# EAGLE design MegaAMP.Mk2 (EAGLE 6.5.0)
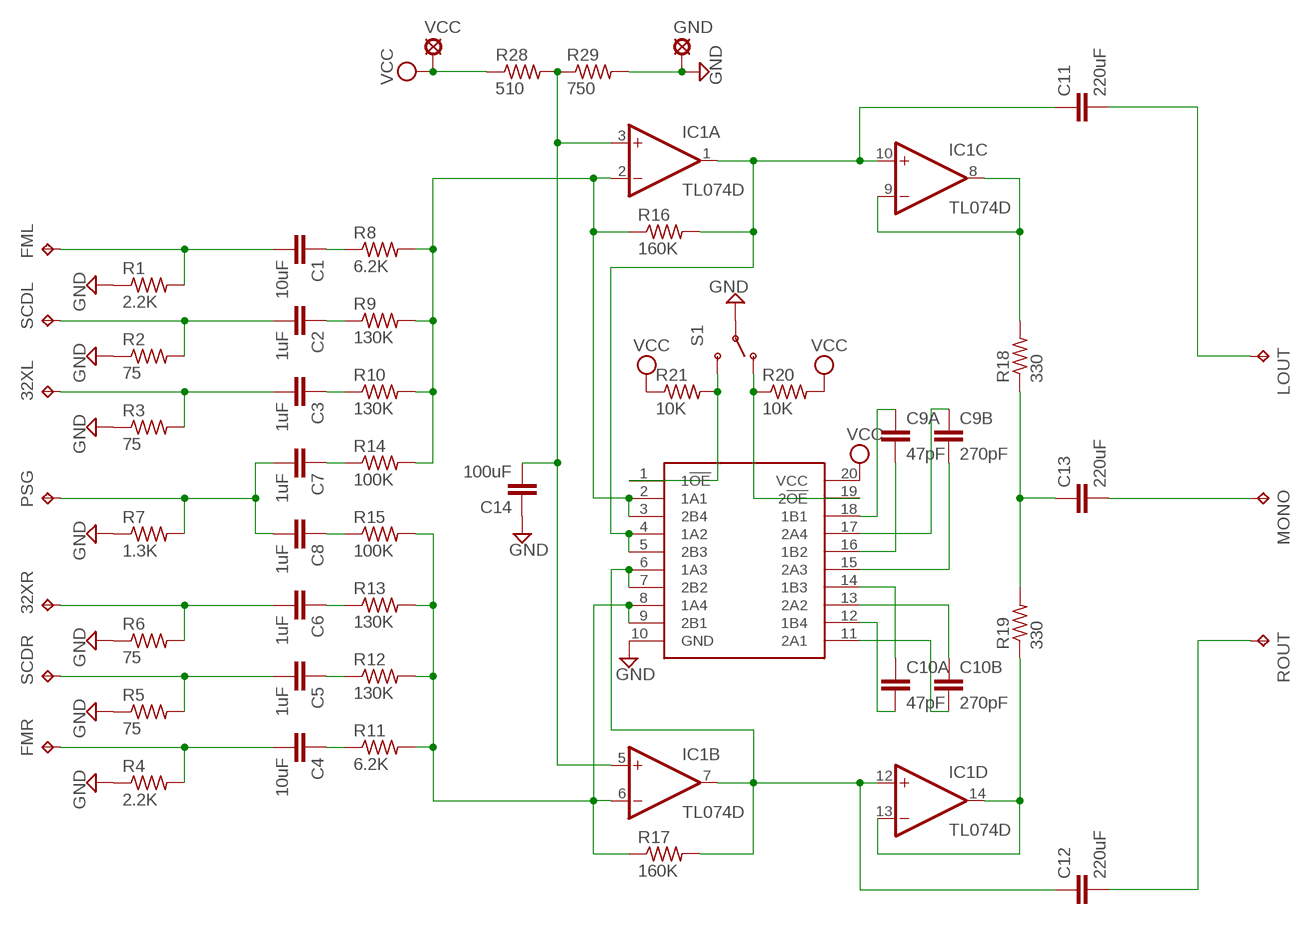
[diagram p0: schematic, sheet 1]

## Parts
32XL  TPTP20R  [TP20R]
32XR  TPTP20R  [TP20R]
C1  10uF  C-EUC0805  [C0805]
C2  1uF  C-EUC0805  [C0805]
C3  1uF  C-EUC0805  [C0805]
C4  10uF  C-EUC0805  [C0805]
C5  1uF  C-EUC0805  [C0805]
C6  1uF  C-EUC0805  [C0805]
C7  1uF  C-EUC0805  [C0805]
C8  1uF  C-EUC0805  [C0805]
C9A  47pF  C-EUC0805  [C0805]
C9B  270pF  C-EUC0805  [C0805]
C10A  47pF  C-EUC0805  [C0805]
C10B  270pF  C-EUC0805  [C0805]
C11  220uF  C-EUC1210  [C1210]
C12  220uF  C-EUC1210  [C1210]
C13  220uF  C-EUC1210  [C1210]
C14  100uF  C-EUC1206  [C1206]
FML  TPTP20R  [TP20R]
FMR  TPTP20R  [TP20R]
GND  LSP13  [LSP13]
IC1  TL074D  [SO14]
LOUT  TPTP20R  [TP20R]
MONO  TPTP20R  [TP20R]
PSG  TPTP20R  [TP20R]
R1  2.2K  R-US_R0805  [R0805]
R2  75  R-US_R0805  [R0805]
R3  75  R-US_R0805  [R0805]
R4  2.2K  R-US_R0805  [R0805]
R5  75  R-US_R0805  [R0805]
R6  75  R-US_R0805  [R0805]
R7  1.3K  R-US_R0805  [R0805]
R8  6.2K  R-US_R0805  [R0805]
R9  130K  R-US_R0805  [R0805]
R10  130K  R-US_R0805  [R0805]
R11  6.2K  R-US_R0805  [R0805]
R12  130K  R-US_R0805  [R0805]
R13  130K  R-US_R0805  [R0805]
R14  100K  R-US_R0805  [R0805]
R15  100K  R-US_R0805  [R0805]
R16  160K  R-US_R0805  [R0805]
R17  160K  R-US_R0805  [R0805]
R18  330  R-US_R0805  [R0805]
R19  330  R-US_R0805  [R0805]
R20  10K  R-US_R0805  [R0805]
R21  10K  R-US_R0805  [R0805]
R28  510  R-US_R0805  [R0805]
R29  750  R-US_R0805  [R0805]
ROUT  TPTP20R  [TP20R]
S1  SWITCH-SPDTPTH  [SWITCH-SPDT]
SCDL  TPTP20R  [TP20R]
SCDR  TPTP20R  [TP20R]
U$1  DBQ(R-PDS0-G20)  [DBQ(R-PDSO-G20)]
VCC  LSP13  [LSP13]

## Nets
GND: C14.1 GND.MP R1.1 R2.1 R3.1 R4.1 R5.1 R6.1 R7.1 R29.2 S1.2(P) U$1.10(GND)
N$1: IC1.2(A:-IN) R8.2 R9.2 R10.2 R14.2 R16.1 U$1.2(1A1) U$1.3(2B4)
N$2: C13.1 R18.1 R19.2
N$3: R21.2 S1.3(S) U$1.1(1!OE)
N$4: C12.2 ROUT.TP
N$5: C14.2 IC1.3(A:+IN) IC1.5(B:+IN) R28.2 R29.1
N$6: C9A.1 U$1.18(1B1)
N$7: IC1.8(C:OUT) IC1.9(C:-IN) R18.2
N$8: C9A.2 U$1.16(1B2)
N$9: IC1.13(D:-IN) IC1.14(D:OUT) R19.1
N$10: C10A.1 U$1.14(1B3)
N$11: C10A.2 U$1.12(1B4)
N$12: R20.1 S1.1(O) U$1.19(2!OE)
N$13: C12.1 IC1.7(B:OUT) IC1.12(D:+IN) R17.2 U$1.6(1A3) U$1.7(2B2)
N$15: C9B.1 U$1.17(2A4)
N$16: C9B.2 U$1.15(2A3)
N$17: C10B.1 U$1.13(2A2)
N$18: C10B.2 U$1.11(2A1)
N$19: IC1.6(B:-IN) R11.2 R12.2 R13.2 R15.2 R17.1 U$1.8(1A4) U$1.9(2B1)
N$20: C11.2 LOUT.TP
N$21: C13.2 MONO.TP
N$22: C1.2 FML.TP R1.2
N$23: C2.2 R2.2 SCDL.TP
N$24: 32XL.TP C3.2 R3.2
N$25: C7.2 C8.2 PSG.TP R7.2
N$26: 32XR.TP C6.2 R6.2
N$27: C5.2 R5.2 SCDR.TP
N$28: C4.2 FMR.TP R4.2
N$29: C1.1 R8.1
N$30: C2.1 R9.1
N$31: C3.1 R10.1
N$32: C7.1 R14.1
N$33: C8.1 R15.1
N$34: C6.1 R13.1
N$35: C5.1 R12.1
N$36: C4.1 R11.1
N$43: C11.1 IC1.1(A:OUT) IC1.10(C:+IN) R16.2 U$1.4(1A2) U$1.5(2B3)
VCC: R20.2 R21.1 R28.1 U$1.20(VCC) VCC.MP

## Power pins joined to a net without a drawn wire
V+: IC1.4(P:V+)
V-: IC1.11(P:V-)

## Library data of the parts
32XL 32XR FML FMR LOUT MONO PSG ROUT SCDL SCDR = testpad:TP: Test pad
C1-C8 C9A C9B C10A C10B = rcl:C-EU: CAPACITOR, European symbol
C11-C14 = resistor:C-EU: CAPACITOR, European symbol
GND VCC = solpad:LSP13: SOLDER PAD drill 1.3 mm, distributor Buerklin, 12H562
IC1 = linear:TL074: OP AMP
R1-R21 R28 R29 = resistor:R-US_: RESISTOR, American symbol
S1 = SparkFun-Electromechanical:SWITCH-SPDT: SPDT Switch Simple slide switch, Spark Fun Electronics SKU : COM-00102 DPDT SMT slide switch, AYZ0202, SWCH-08179
U$1 = TI SN74CBT3244:DBQ(R-PDS0-G20)

## Board
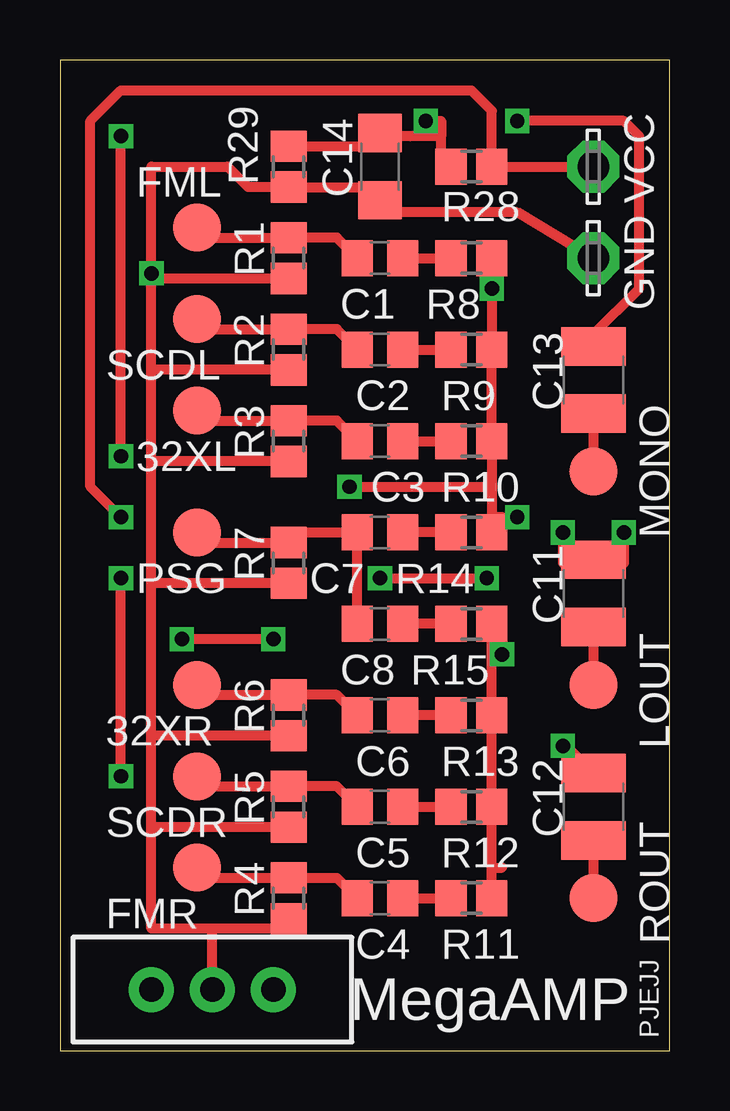
[diagram p1: board, top side]
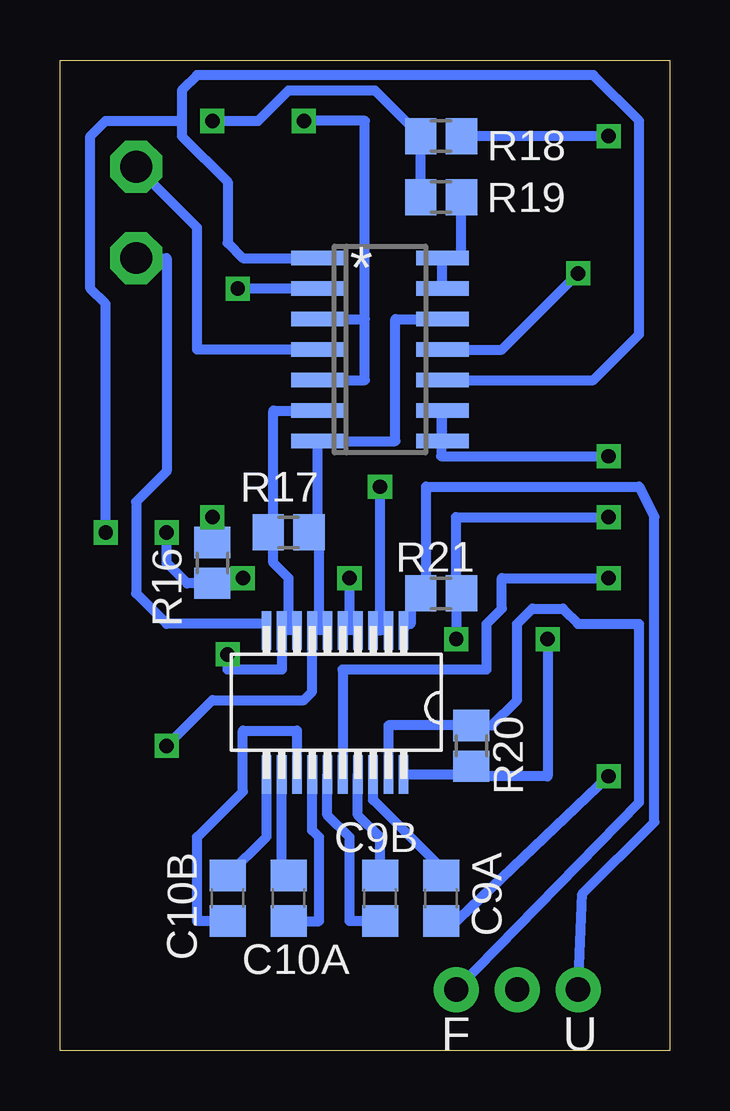
[diagram p2: board, bottom side, seen from below]

Size 25.4 x 41.27 mm. Coordinates in mm from the lower left corner, seen from the top.
Outline: 0,0 25.4,0 25.4,41.27 0,41.27 0,0
Copper layers (1*16): Top 0.035mm / dielectric 1.5mm / Bottom 0.035mm
Design rules "default": minimum track width 10mil, minimum drill 0.6mm, track to track 8mil, track to pad 8mil, pad to pad 8mil, via to via 8mil, smd to smd 8mil, copper to edge 40mil, drill to drill 8mil, minimum pad ring 10mil, minimum via ring 8mil, stop-mask expansion 4mil, vias tented up to drill 0mil, thermal gap 10mil

### Footprints (pad centres in the part's own frame; a part is rotated, then mirrored left to right if it is on the bottom)
TP20R = smd 2 x 2: TP 0,0
C0805 = smd 1.3 x 1.5: 1 -0.95,0; 2 0.95,0
C1210 = smd 1.6 x 2.7: 1 -1.4,0; 2 1.4,0
C1206 = smd 1.6 x 1.8: 1 -1.4,0; 2 1.4,0
LSP13 = drill 1.321 pad 2.159 octagon: MP 0,0
SO14 = smd 0.6 x 2.2: 1 -3.81,-2.6; 2 -2.54,-2.6; 3 -1.27,-2.6; 4 0,-2.6; 5 1.27,-2.6; 6 2.54,-2.6; 7 3.81,-2.6; 8 3.81,2.6; 9 2.54,2.6; 10 1.27,2.6; 11 0,2.6; 12 -1.27,2.6; 13 -2.54,2.6; 14 -3.81,2.6
R0805 = smd 1.3 x 1.5: 1 -0.85,0; 2 0.85,0
SWITCH-SPDT = drill 1.016 pad 1.88: 1 0,2.54; 2 0,0; 3 0,-2.54
DBQ(R-PDSO-G20) = smd 0.4 x 1.6: 1 1.555,-1; 2 2.19,-1; 3 2.825,-1; 4 3.46,-1; 5 4.095,-1; 6 4.73,-1; 7 5.365,-1; 8 6,-1; 9 6.635,-1; 10 7.27,-1; 11 7.27,4.999; 12 6.635,4.999; 13 6,4.999; 14 5.365,4.999; 15 4.73,4.999; 16 4.095,4.999; 17 3.46,4.999; 18 2.825,4.999; 19 2.19,4.999; 20 1.555,4.999

### Placement (x,y rotation side)
32XL  5.71,26.67 0 top
32XR  5.71,15.24 0 top
C1  13.34,33.02 180 top
C2  13.34,29.21 180 top
C3  13.34,25.4 180 top
C4  13.34,6.35 180 top
C5  13.34,10.16 180 top
C6  13.34,13.97 180 top
C7  13.34,21.59 180 top
C8  13.34,17.78 180 top
C9A  9.53,6.35 270 bottom
C9B  12.06,6.35 270 bottom
C10A  15.88,6.35 90 bottom
C10B  18.41,6.35 90 bottom
C11  22.23,19.05 270 top
C12  22.23,10.16 270 top
C13  22.23,27.94 270 top
C14  13.34,36.83 90 top
FML  5.71,34.29 0 top
FMR  5.71,7.62 0 top
GND  22.23,33.02 270 top
IC1  12.06,29.21 270 bottom
LOUT  22.23,15.24 180 top
MONO  22.23,24.13 180 top
PSG  5.71,21.59 0 top
R1  9.53,33.02 90 top
R2  9.53,29.21 90 top
R3  9.53,25.4 90 top
R4  9.53,6.35 90 top
R5  9.53,10.16 90 top
R6  9.53,13.97 90 top
R7  9.53,20.32 90 top
R8  17.14,33.02 0 top
R9  17.14,29.21 0 top
R10  17.14,25.4 0 top
R11  17.14,6.35 0 top
R12  17.14,10.16 0 top
R13  17.14,13.97 0 top
R14  17.14,21.59 0 top
R15  17.14,17.78 0 top
R16  19.05,20.32 270 bottom
R17  15.88,21.59 0 bottom
R18  9.53,38.1 0 bottom
R19  9.53,35.56 180 bottom
R20  8.26,12.7 270 bottom
R21  9.53,19.05 180 bottom
R28  17.14,36.83 180 top
R29  9.53,36.83 270 top
ROUT  22.23,6.35 180 top
S1  6.35,2.54 270 top
SCDL  5.71,30.48 0 top
SCDR  5.71,11.43 0 top
U$1  9.53,16.51 180 bottom
VCC  22.23,36.83 270 top

### Tracks (layer width: path | path; a pad name or v marks a point on that pad's centre or on a via)
GND  (via drill 0.6)
  Top 0.406: R4.1 9.53,5.08 6.35,5.08 | 6.35,5.08 3.81,5.08 3.81,9.31 | 3.81,9.31 3.81,13.12 | 3.81,13.12 3.81,19.47 | 3.81,19.47 3.81,24.55 | 3.81,24.55 3.81,28.36 | 3.81,28.36 3.81,32.17 | 3.81,32.17 v3.81,32.38 3.81,36.83 6.99,36.83 7.83,35.98 R29.2 13.34,35.98 C14.1 13.34,34.92 19.05,34.92 GND.MP | R5.1 3.81,9.31 | R6.1 3.81,13.12 | R3.1 3.81,24.55 | R2.1 3.81,28.36 | R1.1 3.81,32.17 | R7.1 3.81,19.47 | S1.2 6.35,5.08
  Bottom 0.406: U$1.10 16.8,17.78 20.95,17.78 22.23,19.05 22.23,22.86 20.95,24.13 20.95,33.02 GND.MP | 9.53,29.21 6.99,29.21 v3.81,32.38
N$1  (via drill 0.6)
  Top 0.406: v12.06,23.5 18,23.5 | 18.41,21.59 18.41,22.23 | 18.41,22.23 v19.05,22.23 | 18,23.5 R10.2 R9.2 v18,31.75 R8.2 | 18.41,22.23 18,22.23 R14.2 18,23.5
  Bottom 0.406: U$1.2 U$1.3 12.06,17.51 v12.06,23.5 | v19.05,22.23 R16.1 | IC1.2 v18,31.75
N$2  (via drill 0.6)
  Top 0.406: C13.1 22.23,29.84 24.13,31.75 24.13,38.1 23.5,38.73 v19.05,38.73
  Bottom 0.406: R19.2 R18.1 12.28,40.01 15.88,40.01 17.14,38.73 v19.05,38.73
N$3
  Bottom 0.406: U$1.1 11.08,17.78 10.79,17.78 10.79,19.05 R21.2 10.16,19.27 10.16,23.5 1.27,23.5 0.64,22.23 0.64,9.53 3.63,6.53 S1.3
N$4
  Top 0.406: C12.2 ROUT.TP
N$5  (via drill 0.6)
  Top 0.406: R29.1 13.34,37.68 C14.2 | 15.88,38.1 15.88,36.83 R28.2 | 15.88,38.1 14.61,38.1 | 14.61,38.1 13.34,38.1 C14.2 | C14.2 14.61,38.1 | v15.24,38.73 15.88,38.73 15.88,38.1
  Bottom 0.406: 14.61,30.48 IC1.3 12.7,30.48 | IC1.5 12.7,27.94 12.7,30.48 | 12.7,30.48 12.7,38.73 v15.24,38.73
N$6
  Bottom 0.406: C9A.1 9.53,7.62 12.35,10.45 U$1.18
N$7  (via drill 0.6)
  Top 0.406: v2.54,24.77 v2.54,38.1
  Bottom 0.406: IC1.8 IC1.9 9.53,26.67 9.53,24.77 v2.54,24.77 | v2.54,38.1 R18.2
N$8  (via drill 0.6)
  Top 0.406: v2.54,11.43 v2.54,19.68
  Bottom 0.406: C9A.2 9.21,5.08 v2.54,11.43 | U$1.16 13.62,15.88 7.62,15.88 7.62,17.78 6.99,18.41 6.99,19.68 v2.54,19.68
N$9
  Bottom 0.406: IC1.13 IC1.14 8.68,33.02 R19.1
N$10
  Bottom 0.406: C10A.1 14.61,5.4 14.61,8.89 14.89,9.18 U$1.14
N$11
  Bottom 0.406: C10A.2 16.16,7.58 U$1.12
N$12
  Bottom 0.406: U$1.19 11.71,13.55 R20.1 7.41,13.55 6.35,14.61 6.35,17.78 5.71,18.41 4.45,18.41 3.81,17.78 1.27,17.78 1.27,10.34 S1.1
N$13  (via drill 0.6)
  Top 0.406: v20.95,12.7 21.09,12.7 C12.1
  Bottom 0.406: v20.95,12.7 19.05,14.61 15.24,14.61 14.89,14.96 U$1.7 U$1.6 14.26,17.78 14.61,17.78 14.61,21.59 14.66,21.59 | 14.66,21.59 R17.2 | 14.66,21.59 IC1.7 11.43,25.4 11.43,30.48 IC1.12
N$15
  Bottom 0.406: C9B.1 12.06,8.89 12.98,9.81 U$1.17
N$16
  Bottom 0.406: C9B.2 13.34,5.4 13.34,8.89 14.26,9.81 U$1.15
N$17
  Bottom 0.406: C10B.1 19.68,5.4 19.68,8.89 17.78,10.79 17.78,13.34 15.53,13.34 U$1.13
N$18
  Bottom 0.406: C10B.2 16.8,8.92 U$1.11
N$19  (via drill 0.6)
  Top 0.406: 18.41,7.62 18,7.62 R11.2 R12.2 R13.2 R15.2 18.41,17.78 v18.41,16.51 | 18,16.51 v18.41,16.51 | v18.41,16.51 18.41,17.36
  Bottom 0.406: v18.41,16.51 18.41,15.88 16.16,15.88 U$1.9 U$1.8 15.53,17.78 15.88,17.78 15.88,19.68 16.51,20.32 16.51,21.38 R17.1 16.51,21.59 16.51,26.67 IC1.6
N$20
  Top 0.406: C11.2 LOUT.TP
N$21
  Top 0.406: C13.2 MONO.TP
N$22
  Top 0.406: FML.TP 6.13,33.87 R1.2 11.54,33.87 C1.2
N$23
  Top 0.406: SCDL.TP 6.13,30.06 R2.2 11.54,30.06 C2.2
N$24
  Top 0.406: 32XL.TP 6.13,26.25 R3.2 11.54,26.25 C3.2
N$25
  Top 0.406: C8.2 C7.2 9.95,21.59 R7.2 6.13,21.17 PSG.TP
N$26
  Top 0.406: C6.2 11.54,14.82 R6.2 6.13,14.82 32XR.TP
N$27
  Top 0.406: R5.2 9.53,11.43 | C5.2 11.54,11.01 R5.2 | SCDR.TP 6.13,11.01 R5.2
N$28
  Top 0.406: 9.11,7.62 R4.2 | R4.2 11.54,7.2 C4.2 | FMR.TP 6.13,7.2 R4.2
N$29
  Top 0.406: C1.1 R8.1
N$30
  Top 0.406: C2.1 R9.1
N$31
  Top 0.406: C3.1 R10.1
N$32
  Top 0.406: R14.1 C7.1
N$33
  Top 0.406: R15.1 C8.1
N$34
  Top 0.406: R13.1 C6.1
N$35
  Top 0.406: C5.1 R12.1
N$36
  Top 0.406: C4.1 R11.1
N$40  (via drill 0.6)
  other vias: 20.95,12.7
N$42  (via drill 0.6)
  other vias: 18.41,16.51
N$43  (via drill 0.6)
  Top 0.406: v13.34,19.68 v17.78,19.68 | v20.95,21.59 20.95,20.32 22.09,20.32 C11.1 22.23,20.32 23.5,20.32 v23.5,21.59
  Bottom 0.406: v23.5,21.59 23.5,31.11 24.13,31.75 24.13,38.1 23.5,38.73 20.32,38.73 | U$1.4 U$1.5 13.34,17.8 v13.34,19.68 | v17.78,19.68 18,19.47 R16.2 20.11,19.47 20.95,20.32 v20.95,21.59 | IC1.10 3.17,27.94 1.27,29.84 1.27,38.73 3.17,40.64 19.68,40.64 20.32,40.01 20.32,38.73 | IC1.1 17.78,33.02 18.41,33.66 18.41,36.2 20.32,38.1 20.32,38.73
VCC  (via drill 0.6)
  Top 0.406: VCC.MP R28.1 18,39.16 17.14,40.01 2.54,40.01 1.27,38.73 1.27,23.5 v2.54,22.23 | v8.89,17.14 v5.08,17.14
  Bottom 0.406: 14.61,29.21 19.68,29.21 19.68,34.29 VCC.MP | U$1.20 8.26,11.51 R20.2 8.26,11.43 5.08,11.43 v5.08,17.14 | R21.1 8.89,19.05 | 8.89,19.05 v8.89,17.14 | 8.89,19.05 8.89,22.23 v2.54,22.23

### Text on the board
bPlace: *
tNames: PJEJJ | MegaAMP
bNames: U | F